# EAGLE design breakoutResistor (EAGLE 7.3.0)
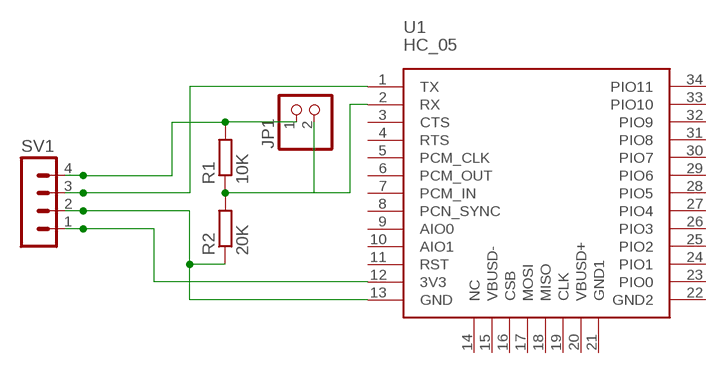
[diagram p0: schematic, sheet 1]

## Parts
JP1  PINHD-1X2  [1X02]
R1  10K  R-EU_R0805  [R0805]
R2  20K  R-EU_R0805  [R0805]
SV1  MA04-1  [MA04-1]
U1  HC_05  [BLUETOOTH_SMD]

## Nets
N$2: R2.1 SV1.2 U1.13(GND)
N$3: JP1.1 R1.2 SV1.4
N$4: SV1.3 U1.1(TX)
N$5: SV1.1 U1.12(3V3)
N$6: JP1.2 R1.1 R2.2 U1.2(RX)
Unconnected: U1.3(CTS) U1.4(RTS) U1.5(PCM_CLK) U1.6(PCM_OUT) U1.7(PCM_IN) U1.8(PCN_SYNC) U1.9(AIO0) U1.10(AIO1) U1.11(RST) U1.14(NC) U1.15(VBUSD-) U1.16(CSB) U1.17(MOSI) U1.18(MISO) U1.19(CLK) U1.20(VBUSD+) U1.21(GND1) U1.22(GND2) U1.23(PIO0) U1.24(PIO1) U1.25(PIO2) U1.26(PIO3) U1.27(PIO4) U1.28(PIO5) U1.29(PIO6) U1.30(PIO7) U1.31(PIO8) U1.32(PIO9) U1.33(PIO10) U1.34(PIO11)

## Library data of the parts
JP1 = pinhead:PINHD-1X2: PIN HEADER
R1 R2 = rcl:R-EU_: RESISTOR, European symbol
SV1 = con-lstb:MA04-1: PIN HEADER; OC_FARNELL: unknown; OC_NEWARK: unknown
U1 = SerialPortBluetooth:HC_05

## Board
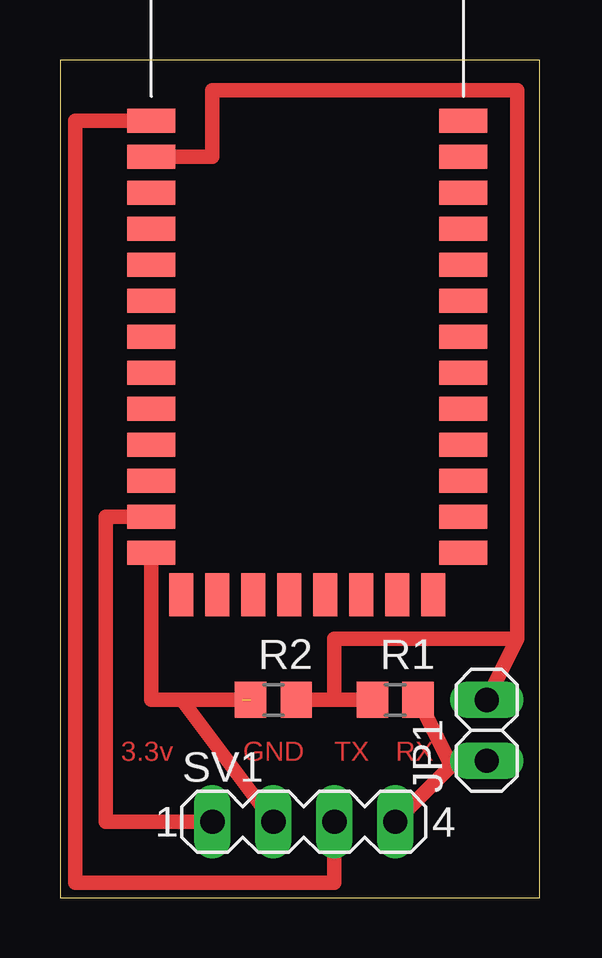
[diagram p1: board, top side]

Size 19.99 x 34.91 mm. Coordinates in mm from the lower left corner, seen from the top.
Outline: 0,0 19.99,0 19.99,34.91 0,34.91 0,0
Copper layers (1*16): Top 0.035mm / dielectric 1.5mm / Bottom 0.035mm
Design rules "default": minimum track width 10mil, minimum drill 24mil, track to track 8mil, track to pad 8mil, pad to pad 8mil, via to via 8mil, smd to smd 8mil, copper to edge 40mil, drill to drill 8mil, minimum pad ring 10mil, minimum via ring 8mil, stop-mask expansion 4mil, vias tented up to drill 0mil, thermal gap 10mil

### Footprints (pad centres in the part's own frame; a part is rotated, then mirrored left to right if it is on the bottom)
1X02 = drill 1.016 long: 1 -1.27,0; 2 1.27,0
R0805 = smd 1.3 x 1.5: 1 -0.95,0; 2 0.95,0
MA04-1 = drill 1.016 long: 1 -3.81,0; 2 -1.27,0; 3 1.27,0; 4 3.81,0
BLUETOOTH_SMD = smd 2 x 1: 1 0,0; 2 0,-1.5; 3 0,-3; 4 0,-4.5; 5 0,-6; 6 0,-7.5; 7 0,-9; 8 0,-10.5; 9 0,-12; 10 0,-13.5; 11 0,-15; 12 0,-16.5; 13 0,-18; 22 13,-18; 23 13,-16.5; 24 13,-15; 25 13,-13.5; 26 13,-12; 27 13,-10.5; 28 13,-9; 29 13,-7.5; 30 13,-6; 31 13,-4.5; 32 13,-3; 33 13,-1.5; 34 13,0 | smd 1 x 1.8: 14 1.25,-19.75; 15 2.75,-19.75; 16 4.25,-19.75; 17 5.75,-19.75; 18 7.25,-19.75; 19 8.75,-19.75; 20 10.25,-19.75; 21 11.75,-19.75

### Placement (x,y rotation side)
JP1  17.78,6.99 90 top
R1  13.97,8.26 0 top
R2  8.89,8.26 0 top
SV1  10.16,3.17 0 top
U1  3.81,32.39 0 top

### Tracks (layer width: path | path; a pad name or v marks a point on that pad's centre or on a via)
N$2  (1 unrouted)
  Top 0.61: 7.62,8.26 5.08,8.26 | 5.08,8.26 3.81,8.26 U1.13 | SV1.2 5.08,8.26
N$3
  Top 0.61: SV1.4 16.19,5.4 16.19,5.71 | 16.19,5.71 R1.2 | JP1.1 16.19,5.71
N$4
  Top 0.61: SV1.3 11.43,0.64 0.64,0.64 0.64,32.39 U1.1
N$5
  Top 0.61: U1.12 1.9,15.88 1.9,3.17 SV1.1
N$6
  Top 0.61: 11.43,8.26 R1.1 | R2.2 11.43,8.26 | 11.43,8.26 11.43,10.79 19.05,10.79 | 19.05,10.79 19.05,33.66 6.35,33.66 6.35,30.88 U1.2 | JP1.2 19.05,10.79

### Text on the board
Top: 3.3v | GND | TX | RX